# Altium schematic sheet connectors.SchDoc: Keymap Layout
size A3; Author: Daniele Basile <asterix24@gmail.com>; Organization: Altium Limited; Address1: L3, 12a Rodborough Rd; Address2: Frenchs Forest; Address3: NSW; Address4: Australia 2086; DocumentNumber: 2; Revision: Rev.A; SheetNumber: 2; SheetTotal: 2
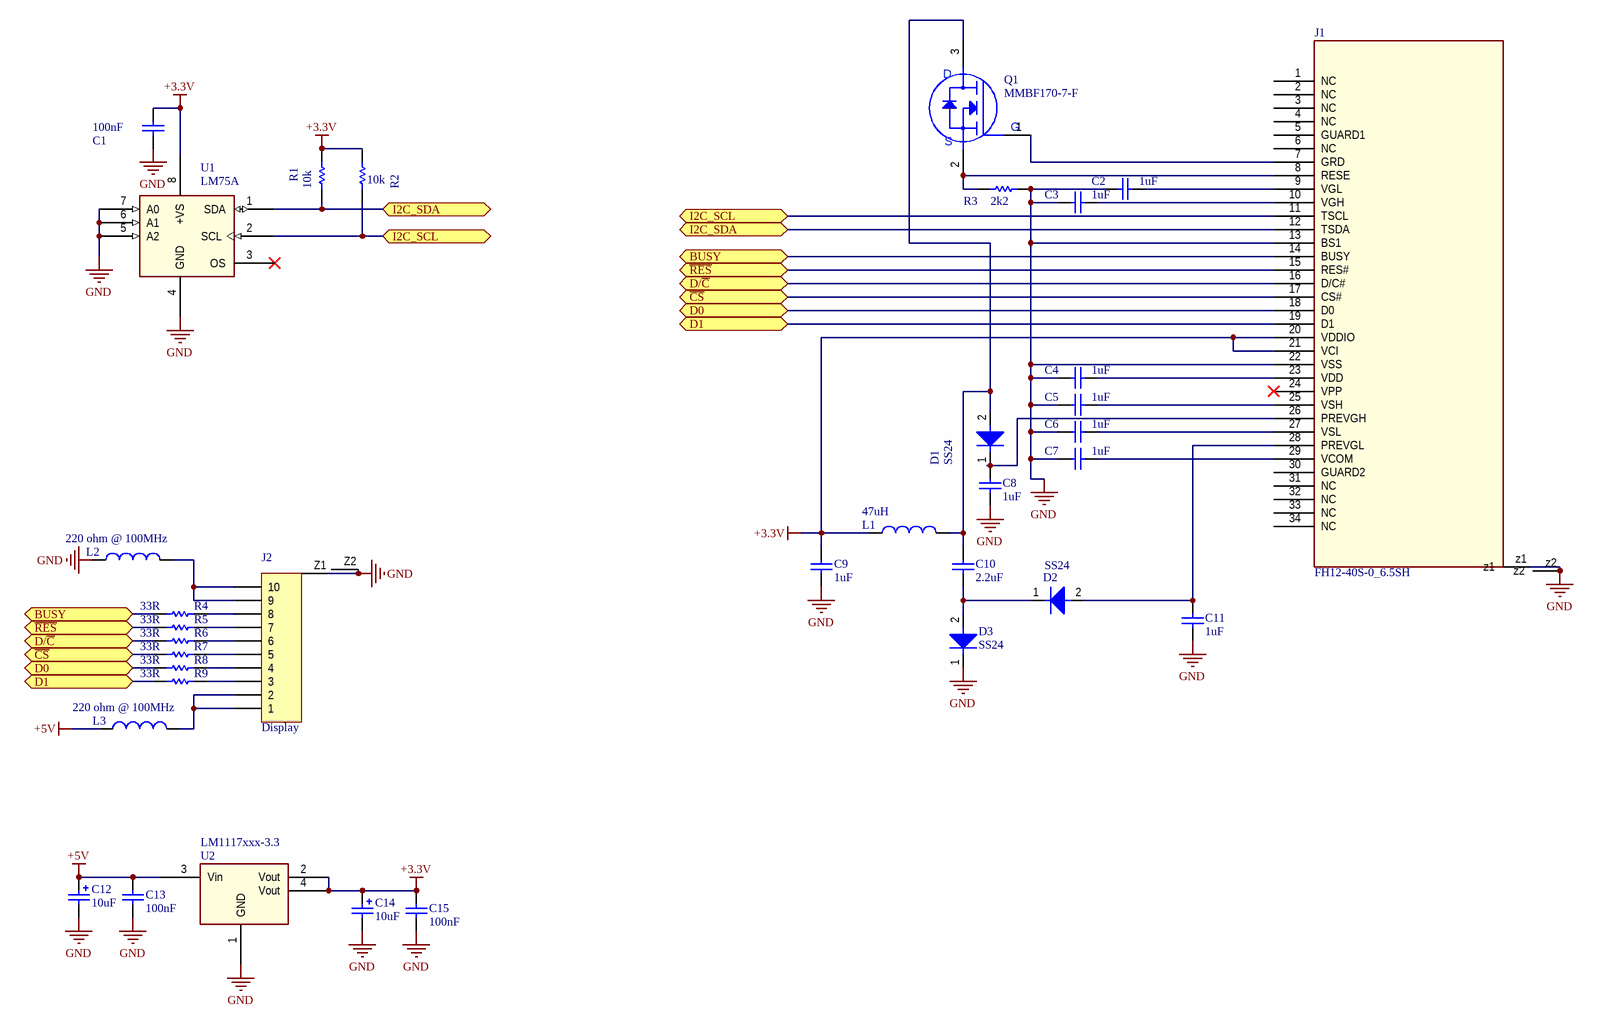
[diagram p0: connectors.SchDoc]

## Parts
C1  100nF  [0603_[1608]]
C2  1uF  [0603_[1608]]
C3  1uF  [0603_[1608]]
C4  1uF  [0603_[1608]]
C5  1uF  [0603_[1608]]
C6  1uF  [0603_[1608]]
C7  1uF  [0603_[1608]]
C8  1uF  [0603_[1608]]
C9  1uF  [0603_[1608]]
C10  2.2uF  [0603_[1608]]
C11  1uF  [0603_[1608]]
C12  10uF  [1206_[3216]]
C13  100nF  [0603_[1608]]
C14  10uF  [1206_[3216]]
C15  100nF  [0603_[1608]]
D1  SS24  [DO214AA_12]
D2  SS24  [DO214AA_12]
D3  SS24  [DO214AA_12]
J1  FH12-40S-0_6.5SH  [fcp_zif_34pin_0,5mm]
J2  Display  [fcc-zif_10pin_0.5mm]
L1  47uH  [0805_[2012]]
L2  220 ohm @ 100MHz  [0805_[2012]]
L3  220 ohm @ 100MHz  [0805_[2012]]
Q1  MMBF170-7-F  [sot-23]
R1  10k  [0603_[1608]]
R2  10k  [0603_[1608]]
R3  2k2  [0603_[1608]]
R4  33R  [0603_[1608]]
R5  33R  [0603_[1608]]
R6  33R  [0603_[1608]]
R7  33R  [0603_[1608]]
R8  33R  [0603_[1608]]
R9  33R  [0603_[1608]]
U1  LM75A  [SOIC8]
U2  LM1117xxx-3.3  [SOT-223]

## Ports
BUSY, D0, D1, D/~{C}, I2C_SCL, I2C_SDA, ~{CS}, ~{RES}

## Nets
+3.3V: C1.2 C9.2 C14.1 C15.2 J1.20(VDDIO) J1.21(VCI) L1.1 R1.1 R2.1 U1.8(+VS) U2.2(Vout) U2.4(Vout)
+5V: C12.1 C13.2 L3.1 U2.3(Vin)
GND: C1.1 C2.1 C3.1 C4.1 C5.1 C6.1 C7.1 C8.1 C9.1 C11.1 C12.2 C13.1 C14.2 C15.1 D3.1(K) J1.13(BS1) J1.22(VSS) J1.z1 J1.z2 J2.Z1 J2.Z2 L2.1 R3.1 U1.4(GND) U1.5(A2) U1.6(A1) U1.7(A0) U2.1(GND)
BUSY: J1.14(BUSY) R4.2 ; port BUSY
~{CS}: J1.17(CS#) R7.2 ; port ~{CS}
D0: J1.18(D0) R8.2 ; port D0
D1: J1.19(D1) R9.2 ; port D1
D/~{C}: J1.16(D/C#) R6.2 ; port D/~{C}
I2C_SCL: J1.11(TSCL) R2.2 U1.2(SCL) ; port I2C_SCL
I2C_SDA: J1.12(TSDA) R1.2 U1.1(SDA) ; port I2C_SDA
~{RES}: J1.15(RES#) R5.2 ; port ~{RES}
NetC2_2: C2.2 J1.9(VGL)
NetC3_2: C3.2 J1.10(VGH)
NetC4_2: C4.2 J1.23(VDD)
NetC5_2: C5.2 J1.25(VSH)
NetC6_2: C6.2 J1.27(VSL)
NetC7_2: C7.2 J1.29(VCOM)
NetC8_2: C8.2 D1.1(K) J1.26(PREVGH)
NetC10_1: C10.1 D2.1(K) D3.2(A)
NetC10_2: C10.2 D1.2(A) L1.2 Q1.3(D)
NetC11_2: C11.2 D2.2(A) J1.28(PREVGL)
NetJ1_7: J1.7(GRD) Q1.1(G)
NetJ1_8: J1.8(RESE) Q1.2(S) R3.2
NetJ2_1: J2.1 J2.2 L3.2
NetJ2_3: J2.3 R9.1
NetJ2_4: J2.4 R8.1
NetJ2_5: J2.5 R7.1
NetJ2_6: J2.6 R6.1
NetJ2_7: J2.7 R5.1
NetJ2_8: J2.8 R4.1
NetJ2_9: J2.9 J2.10 L2.2

Not connected (* = marked no-connect by the designer): J1 1(NC) 2(NC) 3(NC) 4(NC) 5(GUARD1) 6(NC) 24(VPP)* 30(GUARD2) 31(NC) 32(NC) 33(NC) 34(NC); U1 3(OS)*

## Notes on the sheet
- Title:
- File:
- asterix24@gmail.com
- Daniele Basile
- Rev:
- Date:
- Time:
- Sheet
- of

## Library data of the parts
C1 = Cap: Ceramic X7R 50V; Value: 10nF; Published: 8-Jun-2000; Revision: July-2002: Re-released for DXP Platform.; Publisher: Altium Limited
C2-C11 = Cap: Ceraminc 25V; Value: 10nF; Published: 8-Jun-2000; Revision: July-2002: Re-released for DXP Platform.; Publisher: Altium Limited
C12 C14 = Cap Pol1: Ceramic X5R 25V; Published: 8-Jun-2000; Revision: July-2002: Re-released for DXP Platform.; Publisher: Altium Limited; Value: 10uF
C13 C15 = Cap: Ceramic X7R 50V; Value: 100pF; Published: 8-Jun-2000; LatestRevisionDate: 17-Jul-2002; LatestRevisionNote: Re-released for DXP Platform.; PackageReference: RAD-0.3; Publisher: Altium Limited; PackageDescription: Radial Cap, Thru-Hole; 2 Leads; 0.3 in Pin Spacing
D1-D3 = Diode: Schottky diode Vf as lower as possible, 0.2 to 0.4V and the repetitive peak reverse voltage > 25V.
J1 = FH12-40S-0_6.5SH: FH34SRJ-34S-0.5SH(50)
J2 = Header 10: Header, 10-Pin; LatestRevisionDate: 17-Jul-2002; LatestRevisionNote: Re-released for DXP Platform.; Publisher: Altium Limited
L1 = Inductor: 0.8A
L2 L3 = Inductor: WE 742792022
Q1 = MOSFET-N 3pin: VDSS=30V, VGS-th<2.5V@250uA.
R1 R2 = Res1: Resistor; Revision: July-2002: Re-released for DXP Platform.
R3-R9 = Res1: Resistor; Value: 1K; Published: 8-Jun-2000; Revision: July-2002: Re-released for DXP Platform.; Publisher: Altium Limited
U1 = LM75: Temperature sensor
U2 = LM1117-FIXED-OUT: LM1117 LDO Fixed output